# EAGLE design sidepcb11-03 (EAGLE 7.7.0)
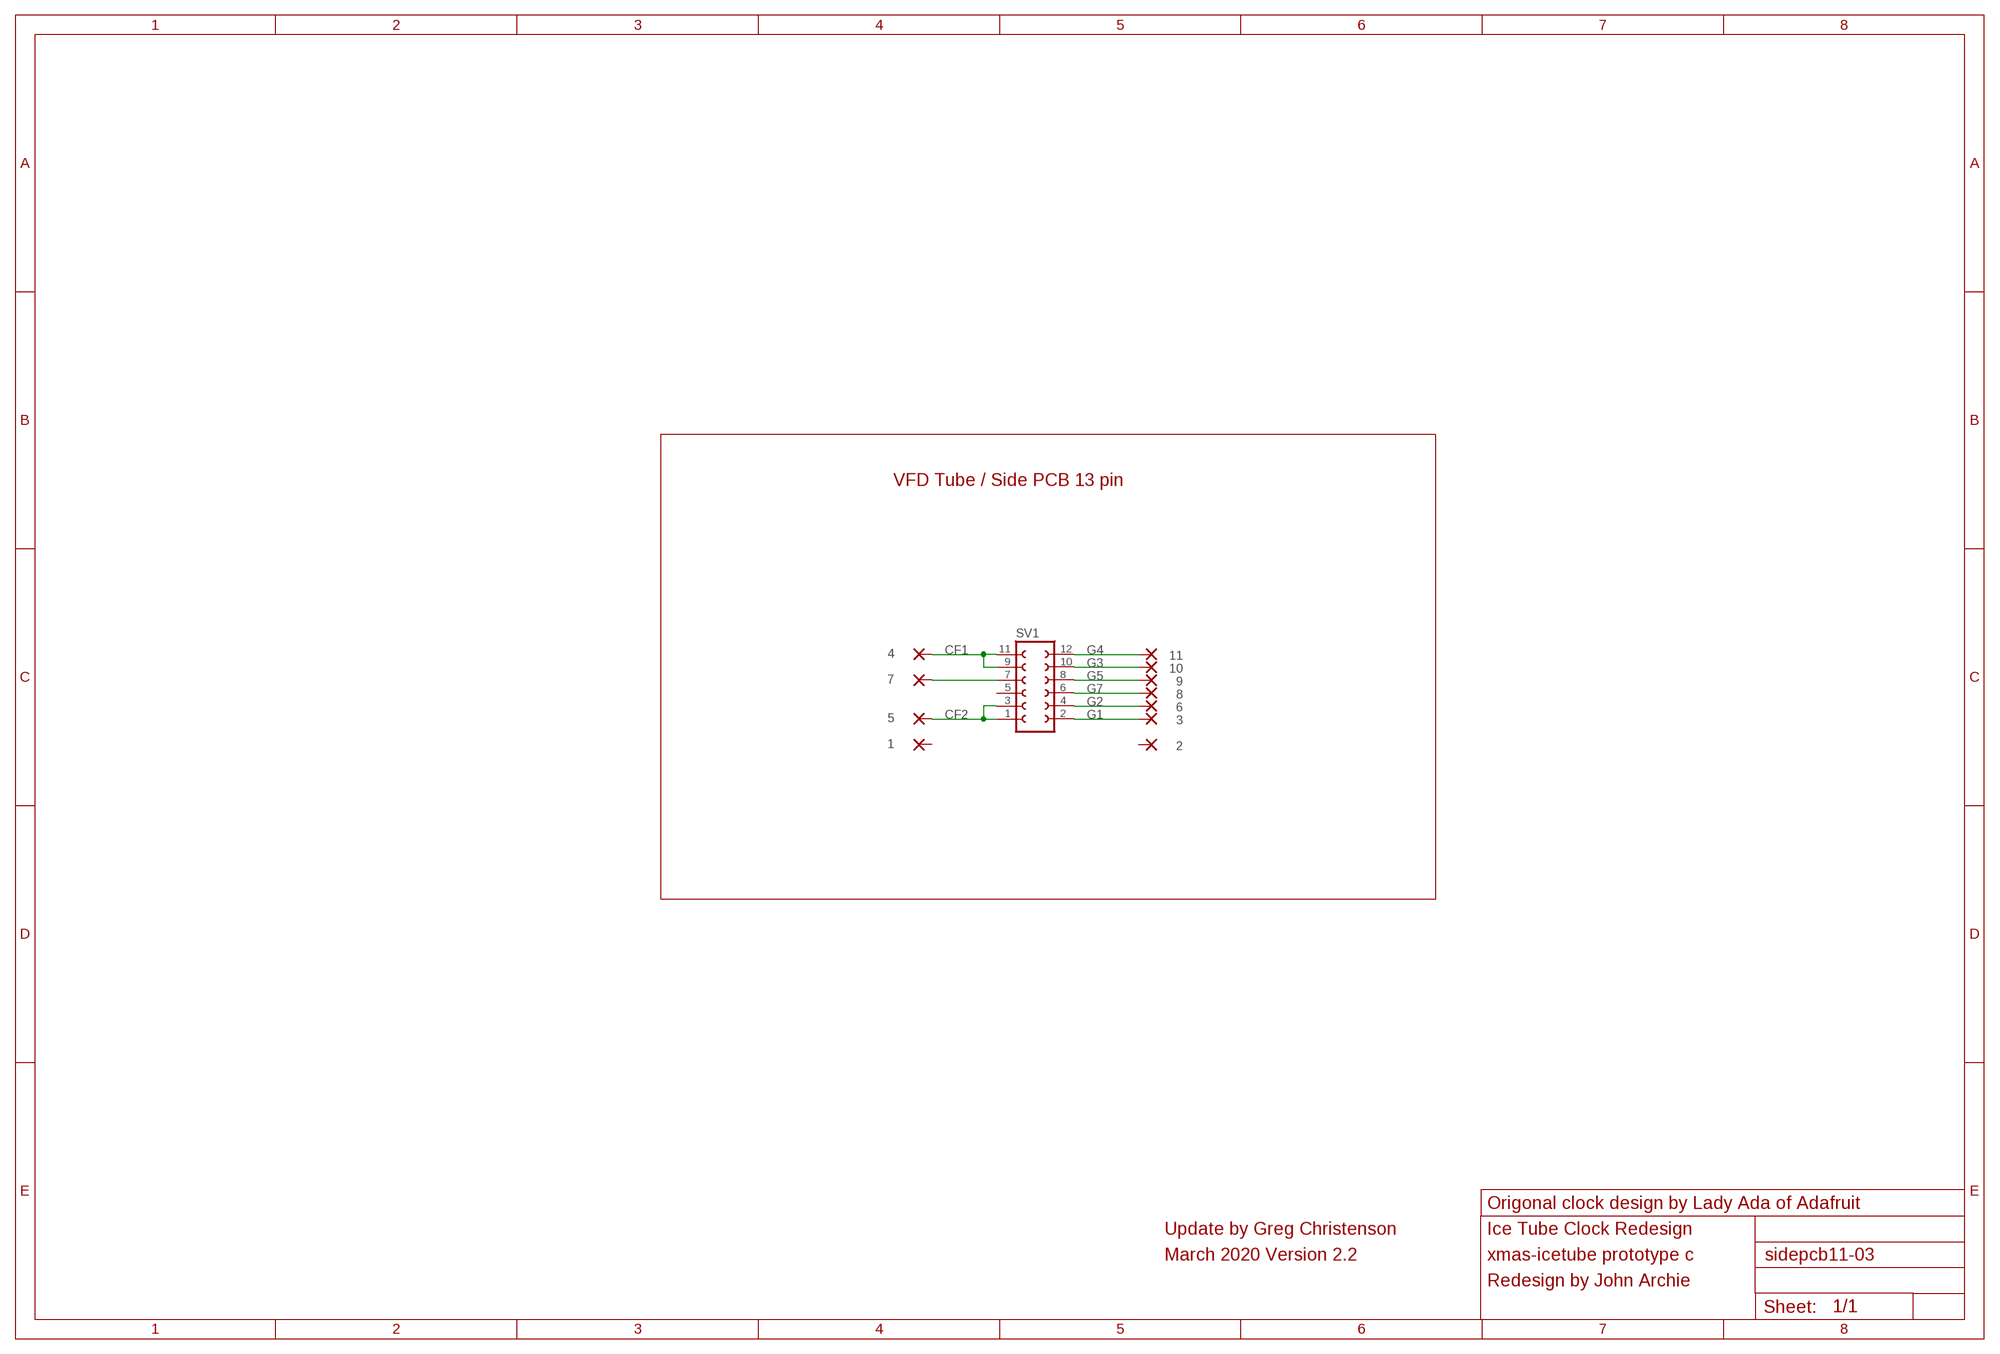
[diagram p0: schematic, sheet 1]

## Parts
1  1,6/0,8  [1,6/0,8]
2  1,6/0,8  [1,6/0,8]
3  1,6/0,8  [1,6/0,8]
4  1,6/0,8  [1,6/0,8]
5  1,6/0,8  [1,6/0,8]
6  1,6/0,8  [1,6/0,8]
7  1,6/0,8  [1,6/0,8]
8  1,6/0,8  [1,6/0,8]
9  1,6/0,8  [1,6/0,8]
10  1,6/0,8  [1,6/0,8]
11  1,6/0,8  [1,6/0,8]
SV1  FE06-2W  [FE06-2W]

## Nets
CF1: 4.1(P) SV1.9 SV1.11
CF2: 5.1(P) SV1.1 SV1.3
G1: 3.1(P) SV1.2
G2: 6.1(P) SV1.4
G3: 10.1(P) SV1.10
G4: 11.1(P) SV1.12
G5: 9.1(P) SV1.8
G6: 7.1(P) SV1.7
G7: 8.1(P) SV1.6
Unconnected: 1.1(P) 2.1(P) SV1.5

## Notes on the sheet
- VFD Tube / Side PCB 13 pin
- Origonal clock design by Lady Ada of Adafruit
- Update by Greg Christenson | Ice Tube Clock Redesign
- March 2020 Version 2.2 | xmas-icetube prototype c
- Redesign by John Archie

## Library data of the parts
1-11 = wirepad:1,6/0,8: THROUGH-HOLE PAD
SV1 = con-lsta:FE06-2W: FEMALE HEADER; OC_FARNELL: unknown; OC_NEWARK: unknown

## Net classes
0 default: clearance 0.205 mm

## Board
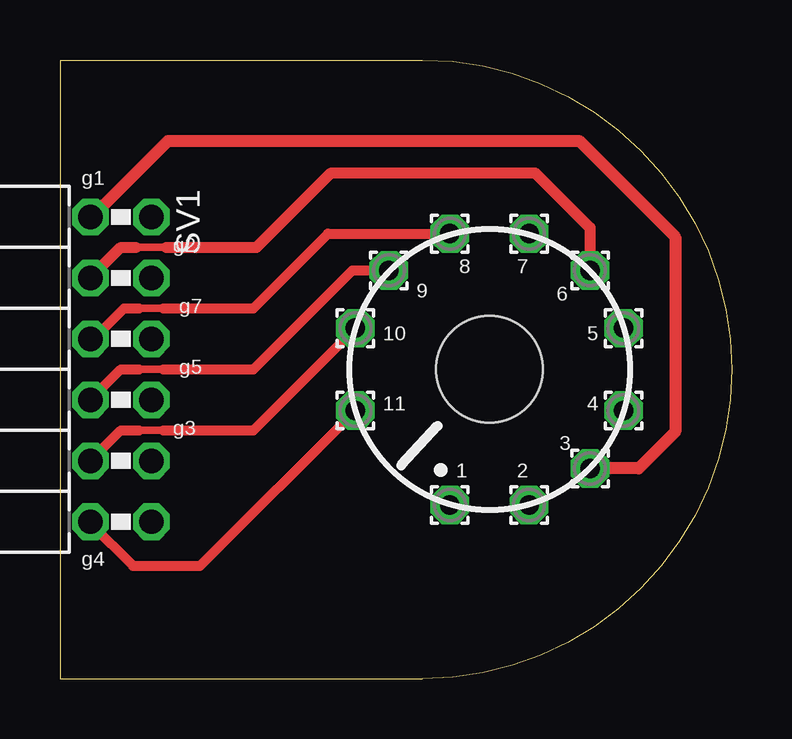
[diagram p1: board, top side]
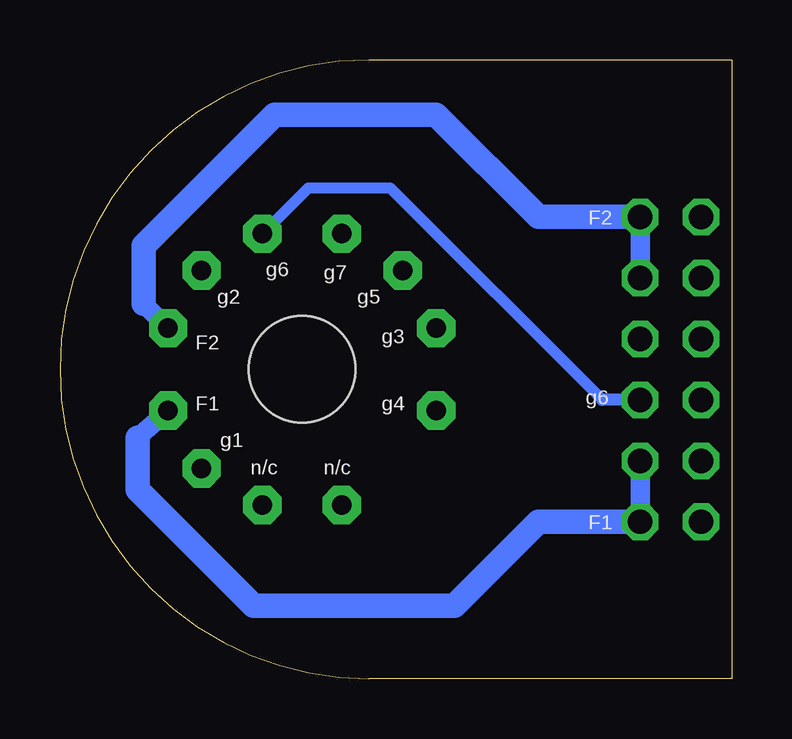
[diagram p2: board, bottom side, seen from below]

Size 28 x 25.78 mm. Coordinates in mm from the lower left corner, seen from the top.
Outline: 0,25.78 0,0 15.11,0 arc180 15.11,25.78 0,25.78
Copper layers (1*16): Top 0.0356mm / dielectric 1.5011mm / Bottom 0.0356mm
Design rules "LaenPCBOrder *": minimum track width 8mil, minimum drill 9mil, track to track 10mil, track to pad 10mil, pad to pad 10mil, via to via 10mil, smd to smd 8mil, copper to edge 15mil, drill to drill 6mil, minimum pad ring 7mil, minimum via ring 7mil, stop-mask expansion 4mil, vias tented up to drill 20mil, thermal gap 10mil
Holes 4.45 mm at 17.91,12.89

### Footprints (pad centres in the part's own frame; a part is rotated, then mirrored left to right if it is on the bottom)
1,6/0,8 = drill 0.813 pad 1.6 octagon: 1 0,0
FE06-2W = drill 1.016 octagon: 1 -6.35,1.27; 2 -6.35,-1.27; 3 -3.81,1.27; 4 -3.81,-1.27; 5 -1.27,1.27; 6 -1.27,-1.27; 7 1.27,1.27; 8 1.27,-1.27; 9 3.81,1.27; 10 3.81,-1.27; 11 6.35,1.27; 12 6.35,-1.27

### Placement (x,y rotation side)
1  16.26,7.24 0 top
2  19.56,7.24 0 top
3  22.1,8.76 0 top
4  23.49,11.18 0 top
5  23.49,14.61 0 top
6  22.1,17.02 0 top
7  19.56,18.54 0 top
8  16.26,18.54 0 top
9  13.72,17.02 0 top
10  12.32,14.61 0 top
11  12.32,11.18 0 top
SV1  2.54,12.89 270 top

### Tracks (layer width: path | path; a pad name or v marks a point on that pad's centre or on a via)
CF1
  Bottom 0.813: 24.77,10.03 24.64,10.16 4.1 | SV1.9 SV1.11
  Bottom 1.016: SV1.11 8.06,6.54 11.56,3.05 19.94,3.05 24.77,7.87 24.77,10.03
CF2
  Bottom 0.813: 24.51,15.62 5.1 | SV1.3 SV1.1
  Bottom 1.016: SV1.1 8.06,19.24 12.32,23.5 19.05,23.5 24.51,18.03 24.51,15.62
G1
  Top 0.406: SV1.2 1.33,19.24
  Top 0.508: 1.33,19.24 4.51,22.42 21.65,22.42 25.65,18.41 25.65,10.29 24.13,8.76 3.1
G2
  Top 0.305: 3.17,17.97 4.45,17.97
  Top 0.457: SV1.4 2.54,17.97 3.17,17.97 | 4.45,17.97 4.57,17.97 8.19,17.97 11.3,21.08 19.81,21.08 22.1,18.8 6.1
G3
  Top 0.305: 3.3,10.35 4.32,10.35
  Top 0.406: SV1.10 2.54,10.35 3.3,10.35 | 4.32,10.35 8.06,10.35 10.1
G4
  Top 0.406: SV1.12 1.27,6.48 3.05,4.7 5.84,4.7 11.1
G5
  Top 0.305: 3.3,12.89 4.32,12.89
  Top 0.406: SV1.8 2.54,12.89 3.3,12.89 | 4.32,12.89 8.06,12.89 12.19,17.02 9.1
G6
  Bottom 0.457: 5.4,11.62 14.22,20.45 17.65,20.45 7.1
  Bottom 0.508: SV1.7 5.4,11.62
G7
  Top 0.305: 3.3,15.43 4.32,15.43
  Top 0.406: SV1.6 1.4,14.16 2.67,15.43 3.3,15.43 | 4.32,15.43 8.06,15.43 11.18,18.54 8.1

### Text on the board
tNames: g1 | g2 | g7 | g5 | g3 | g4
bNames: F2 | g7 | g6 | g5 | g2 | g3 | F2 | g6 | g4 | F1 | g1 | n/c | n/c | F1